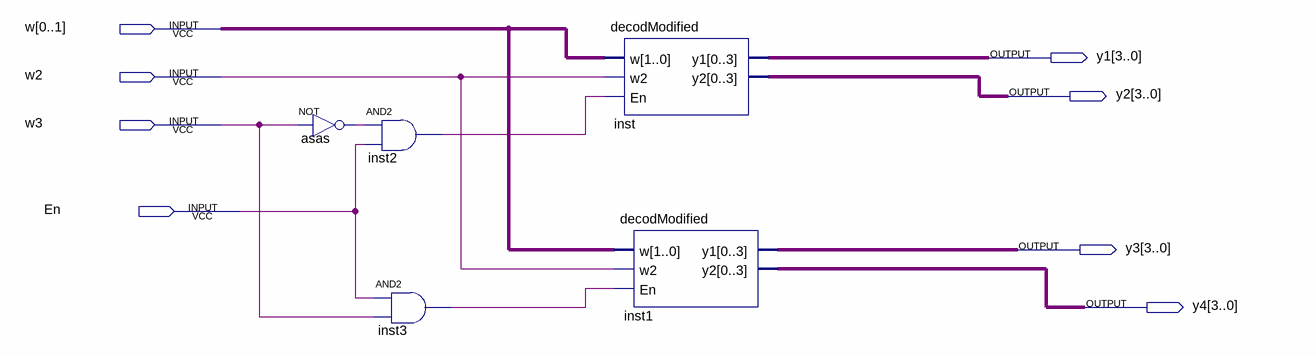
[diagram p0: schematic sheet]
// Quartus schematic 4to16decod.bdf as structural Verilog: 5 symbols, 8 pins
module \4to16decod  (
  input  [0:1] w,
  input  w2,
  input  w3,
  input  En,
  output [3:0] y1,
  output [3:0] y2,
  output [3:0] y3,
  output [3:0] y4
);

  wire asas_out, inst2_out, inst3_out;

  not asas (asas_out, w3);
  and inst2 (inst2_out, asas_out, En);
  and inst3 (inst3_out, En, w3);
  decodModified inst (.w(w), .w2(w2), .En(inst2_out), .y1(y1), .y2(y2));
  decodModified inst1 (.w(w), .w2(w2), .En(inst3_out), .y1(y3), .y2(y4));
endmodule
